# Altium schematic sheet Main.SchDoc
size A4; SheetNumber: 1; SheetTotal: 1
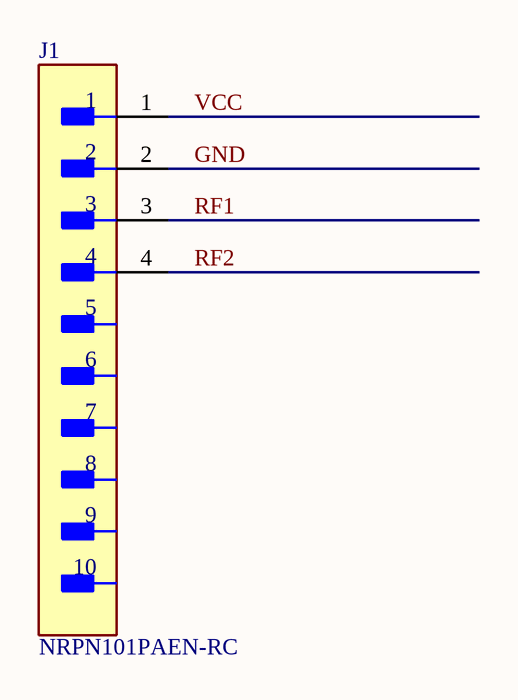
[diagram p0: Main.SchDoc]

## Parts
J1  NRPN101PAEN-RC  [FP-NRPN101PAEN-RC-MFG]

## Nets
GND: J1.2
RF1: J1.3
RF2: J1.4
VCC: J1.1

## Notes on the sheet
- (in symbol CMP-25680-000006-1) 5; 6; 7; 8; 9

## Library data of the parts
J1 = CMP-25680-000006-1: CONN HEADER VERT 10POS 2MM; Manufacturer: Sullins; Current Rating: 2A; Conn Gender: Male; Voltage Rating: 150V; Description: CONN HEADER 2MM SINGLE STR 10POS; Conn Orientation: Straight; Number Of Contacts: 10; Temperature: -40°C to +105°C; Manufacturer Part Number: NRPN101PAEN-RC; Package: 0; Lead Free: Yes; Device Class L3: unset; Octopart: https://octopart.com/nrpn101paen-rc-sullins-18674398; Device Class L1: Connectors; Contact Material: Gold,Nickel; ComponentLink2URL: https://s3.amazonaws.com/catalogspreads-pdf/PAGE104-105%202mm%20MALE%20HDR%20ST%20RA%20SMT.pdf; Footprint Url: https://drawings-pdf.s3.amazonaws.com/10531.pdf; Height: 5.95mm; Digikey Description: CONN HEADER VERT 10POS 2MM; Category: Conn; Automotive: No; Number Of Rows: 1; Device Class L2: Headers and Wire Housings; Temperature Range High: +105°C; Temperature Range Low: -40°C; Pitch: 2mm; RoHS: TRUE; ComponentLink2Description: Datasheet